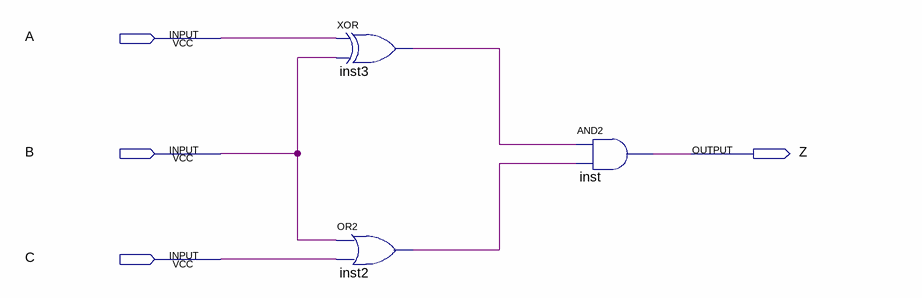
[diagram p0: schematic sheet]
// Quartus schematic LAB1.bdf as structural Verilog: 3 symbols, 4 pins
module LAB1 (
  input  A,
  input  B,
  input  C,
  output Z
);

  wire inst2_out, inst3_out;

  xor inst3 (inst3_out, A, B);
  or inst2 (inst2_out, B, C);
  and inst (Z, inst3_out, inst2_out);
endmodule
